# EAGLE design projek flipflop (EAGLE 9.6.2)
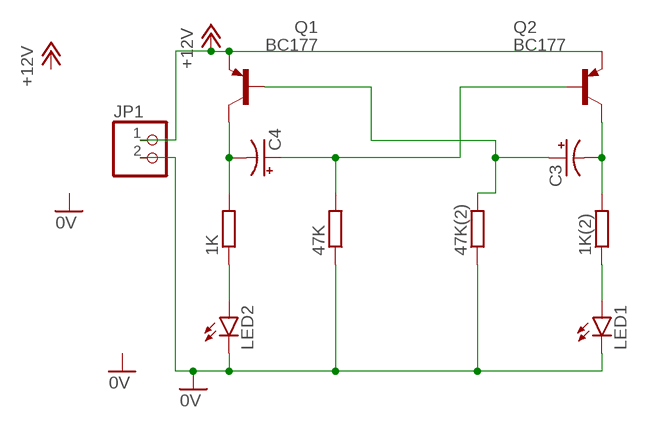
[diagram p0: schematic, sheet 1]

## Parts
1K  R-EU_0207/15  [0207/15]
1K(2)  R-EU_0207/15  [0207/15]
47K  R-EU_0207/15  [0207/15]
47K(2)  R-EU_0207/15  [0207/15]
C3  CPOL-USE2.5-5  [E2,5-5]
C4  CPOL-USE2.5-5  [E2,5-5]
JP1  PINHD-1X2  [1X02]
LED1  LED5MM  [LED5MM]
LED2  LED5MM  [LED5MM]
Q1  BC177  [TO18]
Q2  BC177  [TO18]

## Nets
0V: 47K(2).1 47K.1 JP1.2 LED1.K(C) LED2.K(C)
+12V: JP1.1 Q1.1(E) Q2.1(E)
N$2: 1K.2 C4.- Q1.3(C)
N$3: 47K(2).2 C3.+ Q1.2(B)
N$4: 47K.2 C4.+ Q2.2(B)
N$5: 1K(2).2 C3.- Q2.3(C)
N$6: 1K.1 LED2.A
N$7: 1K(2).1 LED1.A

## Library data of the parts
1K 1K(2) 47K 47K(2) = rcl:R-EU_: RESISTOR, European symbol; SPICEPREFIX: R
C3 C4 = rcl:CPOL-US: POLARIZED CAPACITOR, American symbol; SPICEPREFIX: C
JP1 = pinhead:PINHD-1X2: PIN HEADER
LED1 LED2 = led:LED: LED OSRAM: - CHIPLED LG R971, LG N971, LY N971, LG Q971, LY Q971, LO R971, LY R971 LH N974, LH R974 LS Q976, LO Q976, LY Q976 LO Q996 - Hyper CHIPLED LW Q18S LB Q993, LB Q99A, LB R99A - SideLED LS A670, LO A670, LY A670, LG A670, LP A670 LB A673, LV A673, LT A673, LW A673 LH A674 LY A675 LS A676, LA A676, LO A676, LY A676, LW A676 LS A679, LY A679, LG A679 - Hyper Micro SIDELED® LS Y876, LA Y876, LO Y876, LY Y876 LT Y87S - SmartLED LW L88C, LW L88S LB L89C, LB L89S, LG L890 LS L89K, LO L89K, LY L89K LS L896, LA L896, LO L896, LY L896 - TOPLED LS T670, LO T670, LY T670, LG T670, LP T670 LSG T670, LSP T670, LSY T670, LOP T670, LYG T670 LG T671, LOG T671, LSG T671 LB T673, LV T673, LT T673, LW T673 LH T674 LS T676, LA T676, LO T676, LY T676, LB T676, LH T676, LSB T676, LW T676 LB T67C, LV T67C, LT T67C, LS T67K, LO T67K, LY T67K, LW E67C LS E67B, LA E67B, LO E67B, LY E67B, LB E67C, LV E67C, LT E67C LW T67C LS T679, LY T679, LG T679 LS T770, LO T770, LY T770, LG T770, LP T770 LB T773, LV T773, LT T773, LW T773 LH T774 LS E675, LA E675, LY E675, LS T675 LS T776, LA T776, LO T776, LY T776, LB T776 LHGB T686 LT T68C, LB T68C - Hyper Mini TOPLED® LB M676 - Mini TOPLED Santana® LG M470 LS M47K, LO M47K, LY M47K Source: http://www.osram.convergy.de LUXEON: - LUMILED® LXK2-PW12-R00, LXK2-PW12-S00, LXK2-PW14-U00, LXK2-PW14-V00 LXK2-PM12-R00, LXK2-PM12-S00, LXK2-PM14-U00 LXK2-PE12-Q00, LXK2-PE12-R00, LXK2-PE12-S00, LXK2-PE14-T00, LXK2-PE14-U00 LXK2-PB12-K00, LXK2-PB12-L00, LXK2-PB12-M00, LXK2-PB14-N00, LXK2-PB14-P00, LXK2-PB14-Q00 LXK2-PR12-L00, LXK2-PR12-M00, LXK2-PR14-Q00, LXK2-PR14-R00 LXK2-PD12-Q00, LXK2-PD12-R00, LXK2-PD12-S00 LXK2-PH12-R00, LXK2-PH12-S00 LXK2-PL12-P00, LXK2-PL12-Q00, LXK2-PL12-R00 Source: www.luxeon.com KINGBRIGHT: KA-3528ASYC Source: www.kingbright.com
Q1 Q2 = transistor-pnp:BC177*: PNP Transistor

## Board
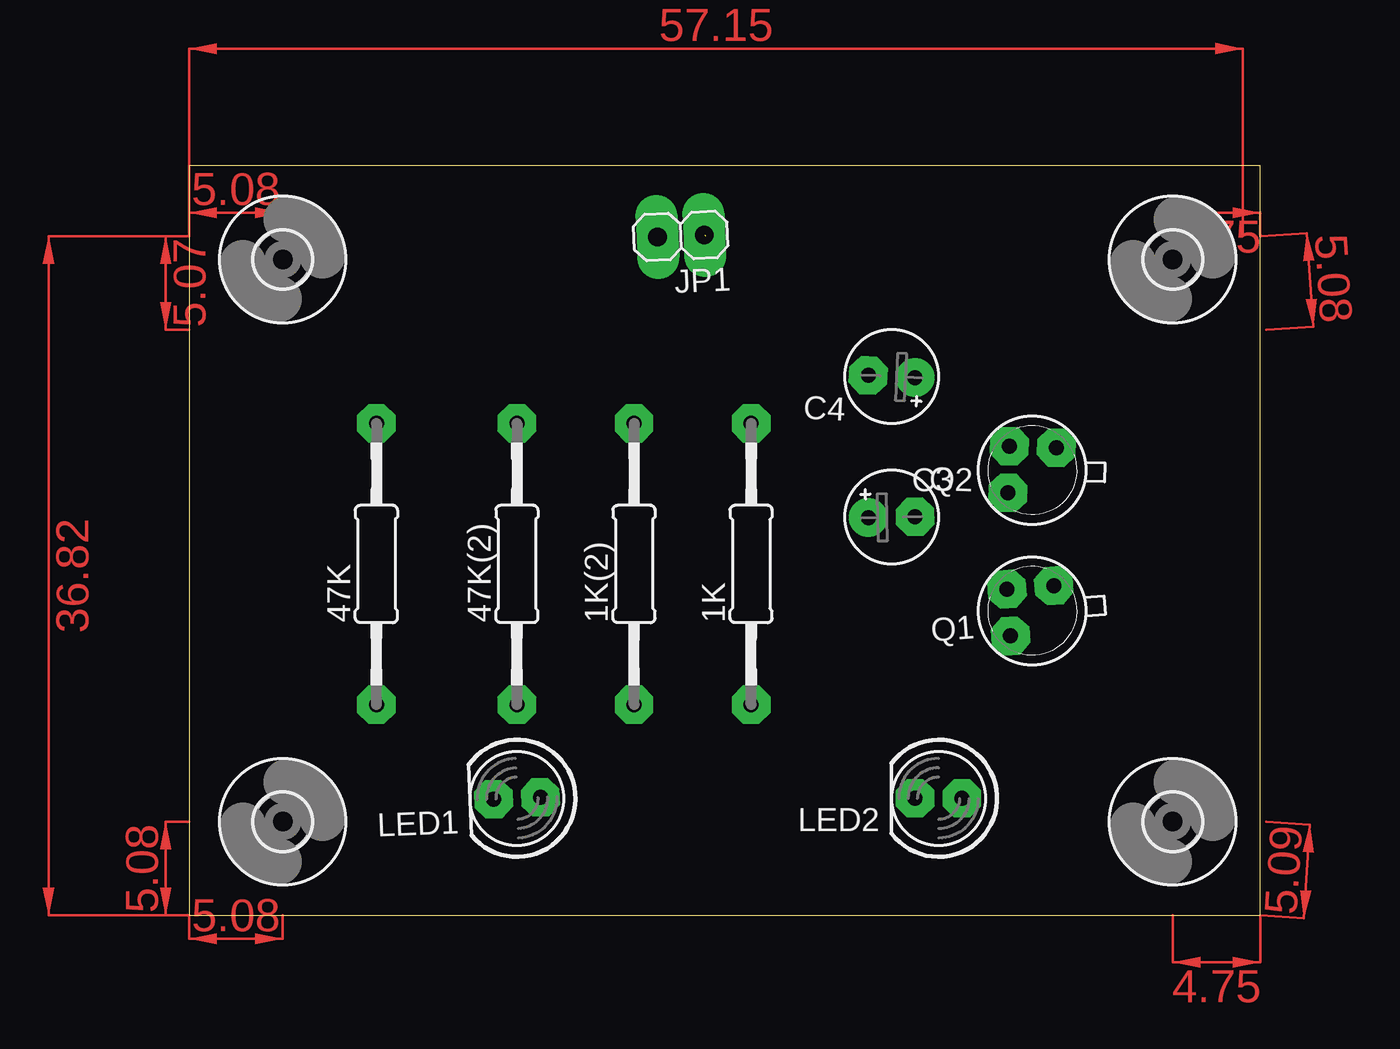
[diagram p1: board, top side]
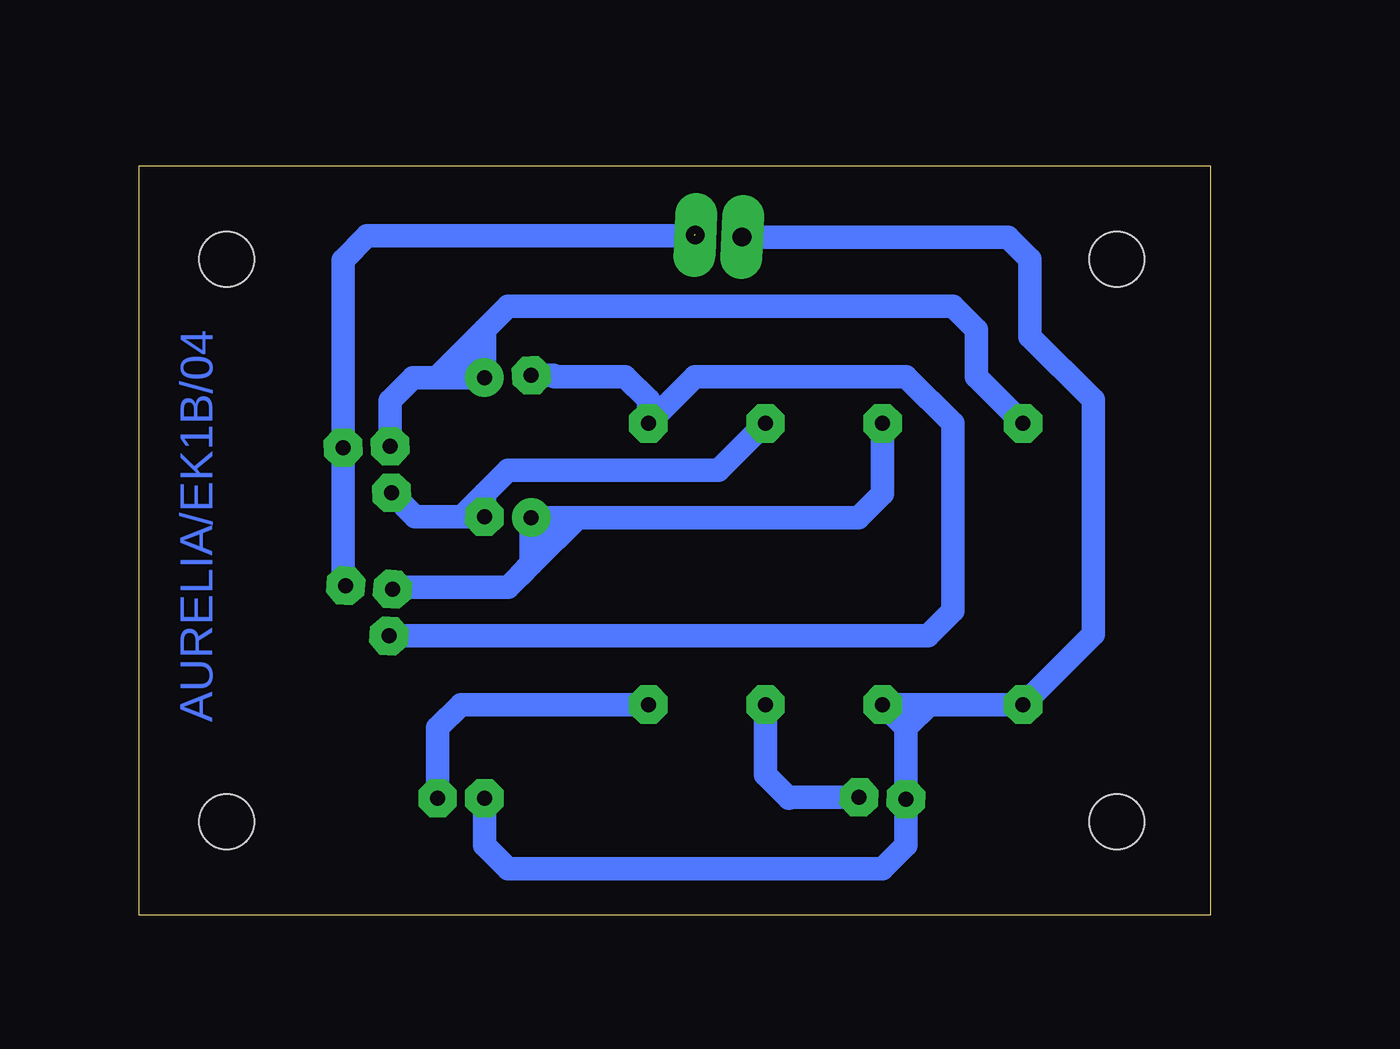
[diagram p2: board, bottom side, seen from below]

Size 58.09 x 40.63 mm. Coordinates in mm from the lower left corner, seen from the top.
Outline: 0,0 58.09,0 58.09,40.63 0,40.63 0,0
Copper layers (1*16): Top 0.035mm / dielectric 1.5mm / Bottom 0.035mm
Design rules "default *": minimum track width 6mil, minimum drill 0.35mm, track to track 6mil, track to pad 6mil, pad to pad 6mil, via to via 6mil, smd to smd 6mil, copper to edge 40mil, drill to drill 6mil, minimum pad ring 25mil, minimum via ring 8mil, stop-mask expansion 4mil, vias tented up to drill 0mil, thermal gap 10mil

### Footprints (pad centres in the part's own frame; a part is rotated, then mirrored left to right if it is on the bottom)
0207/15 = drill 0.813 octagon: 1 -7.62,0; 2 7.62,0
E2,5-5 = drill 0.813 pad 1.6: + -1.27,0 | drill 0.813 pad 1.6 octagon: - 1.27,0
1X02 = drill 1.016 long: 1 -1.27,0; 2 1.27,0
LED5MM = drill 0.813 octagon: A -1.27,0; K 1.27,0
TO18 = drill 0.813 octagon: 1 -1.27,-1.27; 2 1.27,-1.27; 3 1.27,1.27
3,0 = hole 3: 0,0

### Placement (x,y rotation side)
1K  30.48,19.05 90 top
1K(2)  24.13,19.05 90 top
47K  10.16,19.05 90 top
47K(2)  17.78,19.05 90 top
C3  38.1,21.59 1.3 top
C4  38.1,29.21 177.2 top
JP1  26.67,36.83 182.6 top
LED1  17.78,6.35 182.2 top
LED2  40.64,6.35 180 top
Q1  45.72,16.51 184.3 top
Q2  45.72,24.13 178.2 top
U$1  [3,0]  5.08,35.56 0 top
U$2  [3,0]  53.34,35.56 0 top
U$3  [3,0]  53.34,5.08 0 top
U$4  [3,0]  5.08,5.08 0 top

### Tracks (layer width: path | path; a pad name or v marks a point on that pad's centre or on a via)
0V
  Bottom 1.27: 16.51,10.16 LED1.K | 16.52,6.3 LED1.K | LED1.K 16.51,3.81 17.78,2.54 38.1,2.54 39.37,3.81 LED2.K | 15.24,11.43 47K.1 6.35,15.24 6.35,27.94 9.78,31.37 9.78,35.56 10.99,36.77 JP1.2 | 16.51,11.43 15.24,11.43 | 16.51,11.43 47K(2).1 16.51,10.16 | 16.51,11.43 16.51,10.16 | 15.24,11.43 16.51,10.16
+12V  (1 unrouted)
  Bottom 1.27: Q1.1 47.03,18.01 Q2.1 47.03,35.52 45.72,36.83 28,36.83
N$2
  Bottom 1.27: C4.- 35.62,29.27 35.56,29.21 31.75,29.21 30.48,27.94 1K.2 27.94,29.21 16.51,29.21 13.97,26.67 13.97,16.51 15.33,15.15 Q1.3
N$3
  Bottom 1.27: 36.83,19.05 | Q1.2 44.45,17.77 44.45,17.78 38.1,17.78 37.47,18.41 36.83,19.05 | C3.+ 36.83,20.32 | 36.83,20.32 36.83,19.05 | 36.83,19.05 | 47K(2).2 17.78,22.86 19.08,21.56 34.29,21.56 | 34.29,21.56 35.56,21.56 | 35.56,21.56 C3.+ | 35.56,21.56 36.8,20.32 36.83,20.32 | 34.29,21.56 36.8,19.05 36.83,19.05 | C3.+ 36.83,19.05
N$4
  Bottom 1.27: C4.+ | C4.+ 39.37,30.48 | 39.37,30.48 39.37,31.75 | 39.37,31.75 38.1,33.02 13.97,33.02 12.7,31.75 12.7,29.21 47K.2 | C4.+ 40.64,29.15 | 40.64,29.15 41.91,29.15 | 41.91,29.15 43.24,29.15 44.49,27.9 Q2.2 | 39.37,30.48 40.64,29.21 40.64,29.15 | 39.37,31.75 41.91,29.21 41.91,29.15
N$5
  Bottom 1.27: Q2.3 43.13,21.62 40.64,21.62 40.61,21.62 | 40.61,21.62 C3.- 39.37,22.86 | 39.37,22.86 | 39.37,22.86 38.1,24.13 26.67,24.13 1K(2).2 | 39.37,22.86 40.61,21.62
N$6
  Bottom 1.27: LED2.A 41.91,10.16 40.64,11.43 1K.1
N$7
  Bottom 1.27: LED1.A 22.81,6.4 22.86,6.35 24.13,7.62 1K(2).1
(copper drawn outside any net)
  shapes: Top area x10

### Text on the board
Bottom: AURELIA/EK1B/04